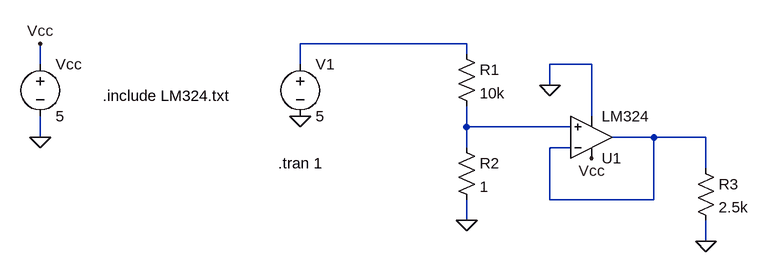
[diagram p0: schematic RhiControl.asc]
RhiControl.asc, the LTspice schematic file:
Version 4
SHEET 1 880 680
WIRE -80 80 -336 80
WIRE -80 96 -80 80
WIRE -736 112 -736 80
WIRE -336 112 -336 80
WIRE 112 112 48 112
WIRE 48 144 48 112
WIRE 112 192 112 112
WIRE -80 208 -80 176
WIRE 80 208 -80 208
WIRE -736 224 -736 192
WIRE 208 224 144 224
WIRE 288 224 208 224
WIRE -80 240 -80 208
WIRE 80 240 48 240
WIRE 288 272 288 224
WIRE 48 320 48 240
WIRE 208 320 208 224
WIRE 208 320 48 320
WIRE -80 352 -80 320
WIRE 288 384 288 352
FLAG -736 80 Vcc
FLAG -736 224 0
FLAG 288 384 0
FLAG -336 192 0
FLAG -80 352 0
FLAG 48 144 0
FLAG 112 256 Vcc
SYMBOL OpAmps\\opamp2 112 288 M180
SYMATTR InstName U1
SYMATTR Value LM324
SYMBOL voltage -736 96 R0
WINDOW 123 0 0 Left 0
WINDOW 39 0 0 Left 0
SYMATTR InstName Vcc
SYMATTR Value 5
SYMBOL res 272 256 R0
SYMATTR InstName R3
SYMATTR Value 2.5k
SYMBOL voltage -336 96 R0
WINDOW 123 0 0 Left 0
WINDOW 39 0 0 Left 0
SYMATTR InstName V1
SYMATTR Value 5
SYMBOL res -96 80 R0
SYMATTR InstName R1
SYMATTR Value 10k
SYMBOL res -96 224 R0
SYMATTR InstName R2
SYMATTR Value 1
TEXT -640 160 Left 2 !.include LM324.txt
TEXT -370 264 Left 2 !.tran 1

The netlist it stands for:
* RhiControl.asc
XU1 N002 N003 Vcc 0 N003 LM324  ; pins In+ In- V+ V- OUT
Vcc Vcc 0 5
R3 N003 0 2.5k
V1 N001 0 5
R1 N001 N002 10k
R2 N002 0 1
.include LM324.txt
.tran 1
.backanno
.end